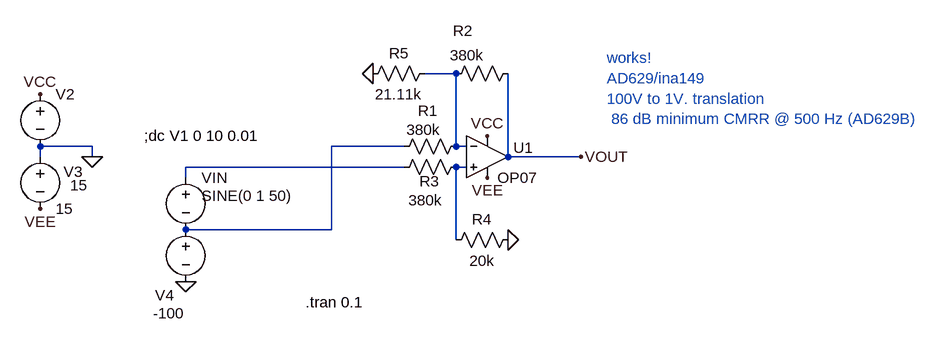
[diagram p0: schematic Draft08.asc]
Draft08.asc, the LTspice schematic file:
Version 4
SHEET 1 1104 680
WIRE 368 -32 320 -32
WIRE -192 80 -272 80
WIRE 288 80 176 80
WIRE 368 80 368 -32
WIRE 384 80 368 80
WIRE -272 96 -272 80
WIRE -192 96 -192 80
WIRE 448 96 448 -32
WIRE 560 96 448 96
WIRE 288 112 -48 112
WIRE 384 112 368 112
WIRE -48 128 -48 112
WIRE 176 208 176 80
WIRE 176 208 -48 208
WIRE 368 224 368 112
FLAG -192 96 0
FLAG 560 96 VOUT
FLAG -48 288 0
FLAG 448 224 0
FLAG -272 0 VCC
FLAG 416 64 VCC
FLAG -272 176 VEE
FLAG 416 128 VEE
FLAG 240 -32 0
SYMBOL voltage -48 112 R0
WINDOW 123 0 0 Left 0
WINDOW 39 0 0 Left 0
WINDOW 3 24 44 Left 2
SYMATTR Value SINE(0 1 50)
SYMATTR InstName VIN
SYMBOL OpAmps\\OP07 416 32 R0
WINDOW 0 40 50 Left 2
SYMATTR InstName U1
SYMBOL voltage -272 -16 R0
WINDOW 123 0 0 Left 0
WINDOW 39 0 0 Left 0
WINDOW 3 46 156 Left 2
SYMATTR Value 15
SYMATTR InstName V2
SYMBOL voltage -272 80 R0
WINDOW 123 0 0 Left 0
WINDOW 39 0 0 Left 0
WINDOW 0 36 39 Left 2
SYMATTR InstName V3
SYMATTR Value 15
SYMBOL res 384 64 R90
WINDOW 0 -23 59 VBottom 2
WINDOW 3 -25 66 VTop 2
SYMATTR InstName R1
SYMATTR Value 380k
SYMBOL res 464 -48 R90
WINDOW 0 -34 85 VBottom 2
WINDOW 3 -28 79 VTop 2
SYMATTR InstName R2
SYMATTR Value 380k
SYMBOL voltage -48 192 R0
WINDOW 0 -47 117 Left 2
WINDOW 3 -50 145 Left 2
WINDOW 123 0 0 Left 0
WINDOW 39 0 0 Left 0
SYMATTR InstName V4
SYMATTR Value -100
SYMBOL res 384 96 R90
WINDOW 0 53 57 VBottom 2
WINDOW 3 51 63 VTop 2
SYMATTR InstName R3
SYMATTR Value 380k
SYMBOL res 464 208 R90
WINDOW 0 0 56 VBottom 2
WINDOW 3 32 56 VTop 2
SYMATTR InstName R4
SYMATTR Value 20k
SYMBOL res 336 -48 R90
WINDOW 0 0 56 VBottom 2
WINDOW 3 32 56 VTop 2
SYMATTR InstName R5
SYMATTR Value 21.11k
TEXT -112 64 Left 2 !;dc V1 0 10 0.01
TEXT 136 320 Left 2 !.tran 0.1
TEXT 600 -56 Left 2 ;works!\nAD629/ina149\n100V to 1V. translation\n 86 dB minimum CMRR @ 500 Hz (AD629B)

The netlist it stands for:
* Draft08.asc
VIN N003 N002 SINE(0 1 50)
XU1 N004 N001 VCC VEE VOUT LT1001  ; OP07, pins In+ In- V+ V- OUT
V2 VCC 0 15
V3 0 VEE 15
R1 N001 N002 380k
R2 VOUT N001 380k
V4 N002 0 -100
R3 N004 N003 380k
R4 0 N004 20k
R5 N001 0 21.11k
;dc V1 0 10 0.01
.tran 0.1
* works!
* AD629/ina149
* 100V to 1V. translation
*  86 dB minimum CMRR @ 500 Hz (AD629B)
.lib LTC.lib
.backanno
.end